# Altium schematic sheet sch_Connet&IMU.SchDoc
size A4
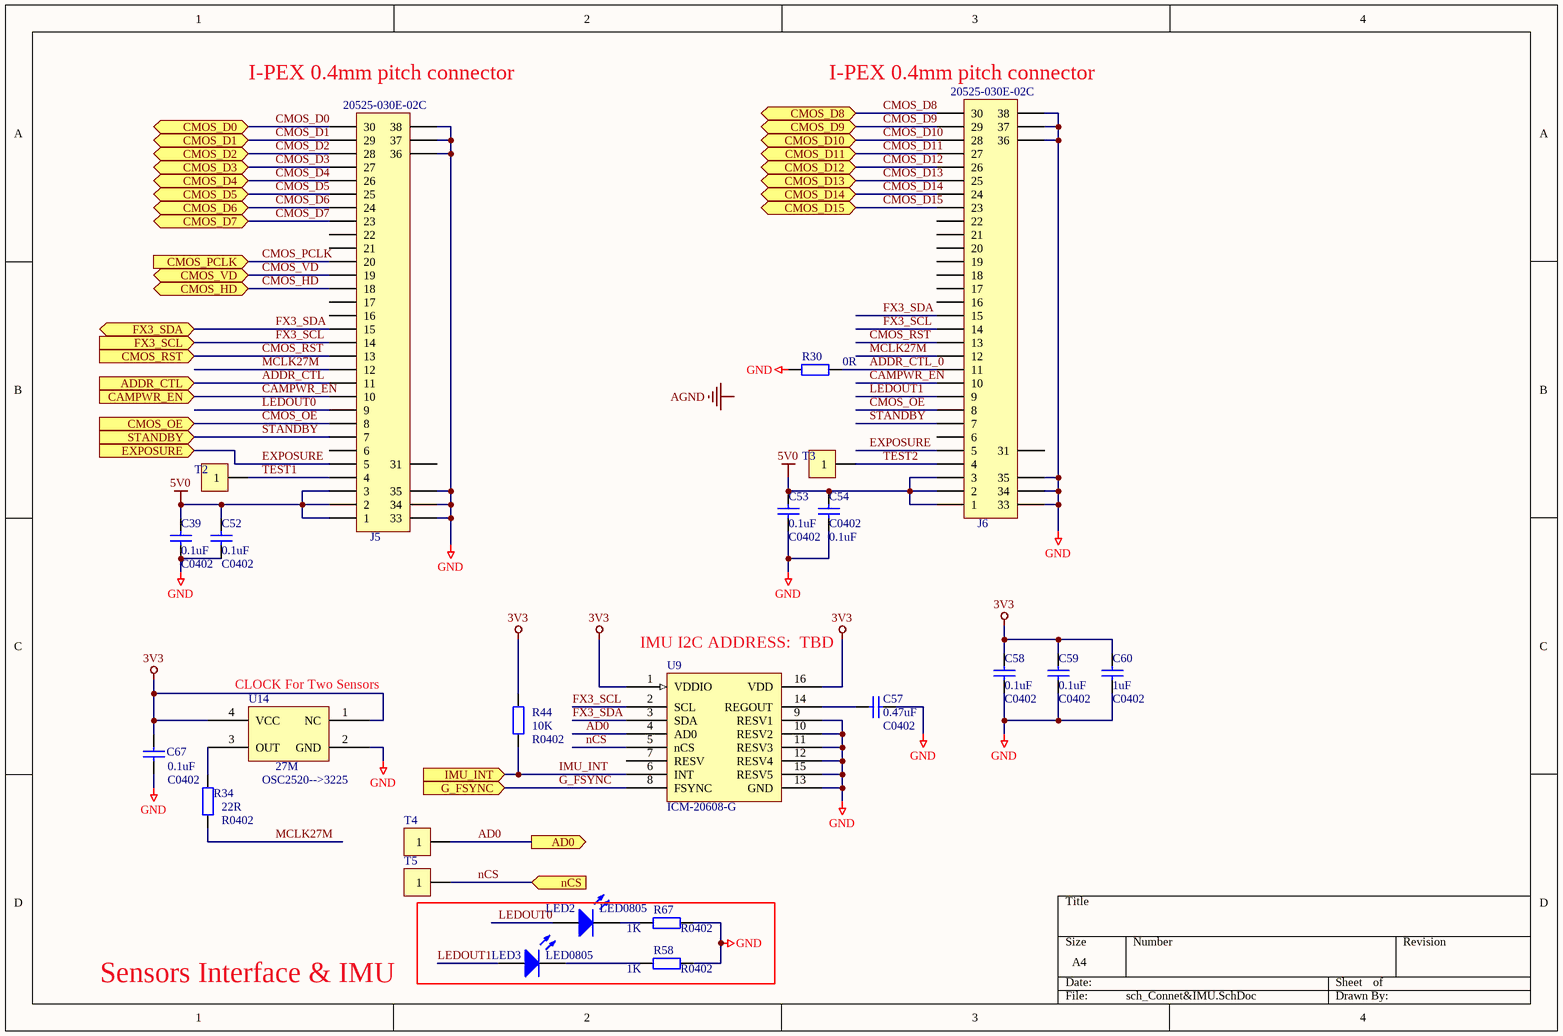
[diagram p0: sch_Connet&IMU.SchDoc]

## Parts
C39  0.1uF  value C0402  [0402C]
C52  0.1uF  value C0402  [0402C]
C53  0.1uF  value C0402  [0402C]
C54  0.1uF  value C0402  [0402C]
C57  0.47uF  value C0402  [0402C]
C58  0.1uF  value C0402  [0402C]
C59  0.1uF  value C0402  [0402C]
C60  1uF  value C0402  [0402C]
C67  0.1uF  value C0402  [0402C]
J5  20525-030E-02C  [HSA30_P40L196W42H10_20525]
J6  20525-030E-02C  [HSA30_P40L196W42H10_20525]
LED2  LED0805  [LED0805A_L210W100H60]
LED3  LED0805  [LED0805A_L210W100H60]
R30  0R  [0402R]
R34  22R  value R0402  [0402R]
R44  10K  value R0402  [0402R]
R58  1K  value R0402  [0402R]
R67  1K  value R0402  [0402R]
T2  CON1  [PAD_TP_D1.2]  (value not drawn)
T3  CON1  [PAD_TP_D1.2]  (value not drawn)
T4  CON1  [PAD_TP_D1.2]  (value not drawn)
T5  CON1  [PAD_TP_D1.2]  (value not drawn)
U9  ICM-20608-G  [LGA16_P50L30W30H08]
U14  OSC2520-->3225  [XTAL_3225]

## Ports
AD0 (out), ADDR_CTL (in), CAMPWR_EN (in), CMOS_D0 (bidir), CMOS_D1 (bidir), CMOS_D2 (bidir), CMOS_D3 (bidir), CMOS_D4 (bidir), CMOS_D5 (bidir), CMOS_D6 (bidir), CMOS_D7 (bidir), CMOS_D8 (bidir), CMOS_D9 (bidir), CMOS_D10 (bidir), CMOS_D11 (bidir), CMOS_D12 (bidir), CMOS_D13 (bidir), CMOS_D14 (bidir), CMOS_D15 (bidir), CMOS_HD (bidir), CMOS_OE (in), CMOS_PCLK (in), CMOS_RST (in), CMOS_VD (bidir), EXPOSURE (in), FX3_SCL (in), FX3_SDA (bidir), G_FSYNC (in), IMU_INT (in), nCS (in), STANDBY (in)

## Nets
3V3: C58.2 C59.2 C60.2 C67.2 R44.2 U9.1(VDDIO) U9.16(VDD) U14.1(NC) U14.4(VCC)
5V0: C39.2 C52.2 C53.2 C54.2 J5.1 J5.2 J5.3 J6.1 J6.2 J6.3
GND: C39.1 C52.1 C53.1 C54.1 C57.1 C58.1 C59.1 C60.1 C67.1 J5.33 J5.34 J5.35 J5.36 J5.37 J5.38 J6.33 J6.34 J6.35 J6.36 J6.37 J6.38 R30.2 R58.1 R67.1 U9.9(RESV1) U9.10(RESV2) U9.11(RESV3) U9.12(RESV4) U9.13(GND) U9.15(RESV5) U14.2(GND)
AD0: T4.1 U9.4(AD0) ; port AD0
ADDR_CTL: J5.11 ; port ADDR_CTL
ADDR_CTL_0: J6.11 R30.1
CAMPWR_EN: J5.10 J6.10 ; port CAMPWR_EN
CMOS_D0: J5.30 ; port CMOS_D0
CMOS_D1: J5.29 ; port CMOS_D1
CMOS_D2: J5.28 ; port CMOS_D2
CMOS_D3: J5.27 ; port CMOS_D3
CMOS_D4: J5.26 ; port CMOS_D4
CMOS_D5: J5.25 ; port CMOS_D5
CMOS_D6: J5.24 ; port CMOS_D6
CMOS_D7: J5.23 ; port CMOS_D7
CMOS_D8: J6.30 ; port CMOS_D8
CMOS_D9: J6.29 ; port CMOS_D9
CMOS_D10: J6.28 ; port CMOS_D10
CMOS_D11: J6.27 ; port CMOS_D11
CMOS_D12: J6.26 ; port CMOS_D12
CMOS_D13: J6.25 ; port CMOS_D13
CMOS_D14: J6.24 ; port CMOS_D14
CMOS_D15: J6.23 ; port CMOS_D15
CMOS_HD: J5.18 ; port CMOS_HD
CMOS_OE: J5.8 J6.8 ; port CMOS_OE
CMOS_PCLK: J5.20 ; port CMOS_PCLK
CMOS_RST: J5.13 J6.13 ; port CMOS_RST
CMOS_VD: J5.19 ; port CMOS_VD
EXPOSURE: J5.5 J6.5 ; port EXPOSURE
FX3_SCL: J5.14 J6.14 U9.2(SCL) ; port FX3_SCL
FX3_SDA: J5.15 J6.15 U9.3(SDA) ; port FX3_SDA
G_FSYNC: U9.8(FSYNC) ; port G_FSYNC
IMU_INT: R44.1 U9.6(INT) ; port IMU_INT
LEDOUT0: J5.9 LED2.1(A)
LEDOUT1: J6.9 LED3.1(A)
MCLK27M: J5.12 J6.12 R34.1
nCS: T5.1 U9.5(nCS) ; port nCS
STANDBY: J5.7 J6.7 ; port STANDBY
TEST1: J5.4 T2.1
TEST2: J6.4 T3.1
NetC57_2: C57.2 U9.14(REGOUT)
NetLED2_2: LED2.2(K) R67.2
NetLED3_2: LED3.2(K) R58.2
NetR34_2: R34.2 U14.3(OUT)

Not connected (* = marked no-connect by the designer): J5 6 16 17 21 22 31; J6 6 16 17 18 19 20 21 22 31; U9 7(RESV)

## Notes on the sheet
- (near J5) I-PEX 0.4mm pitch connector
- (near J6) I-PEX 0.4mm pitch connector
- (near U9) IMU I2C ADDRESS:  TBD
- (near U14) CLOCK For Two Sensors
- (near U14) 27M
- Sensors Interface & IMU
- Labels drawn without touching a wire or pin: AGND

## Library data of the parts
C39 C52-C54 C57-C60 C67 = Cap: Capacitor; Published: 8-Jun-2000; LatestRevisionDate: 17-Jul-2002; LatestRevisionNote: Re-released for DXP Platform.; PackageReference: RAD-0.3; Publisher: Altium Limited
LED2 LED3 = LED: 发光二级管
R30 R34 R44 R58 R67 = Res2: Resistor; Published: 8-Jun-2000; LatestRevisionDate: 17-Jul-2002; LatestRevisionNote: Re-released for DXP Platform.; PackageReference: AXIAL-0.4; Publisher: Altium Limited
  R30: Value: 0R
T2-T5 = CON1: Connector
U14 = XTAL-SPXO: Simple Package Xtal Oscillator